# EAGLE design STM32L486_Test (EAGLE 7.5.0)
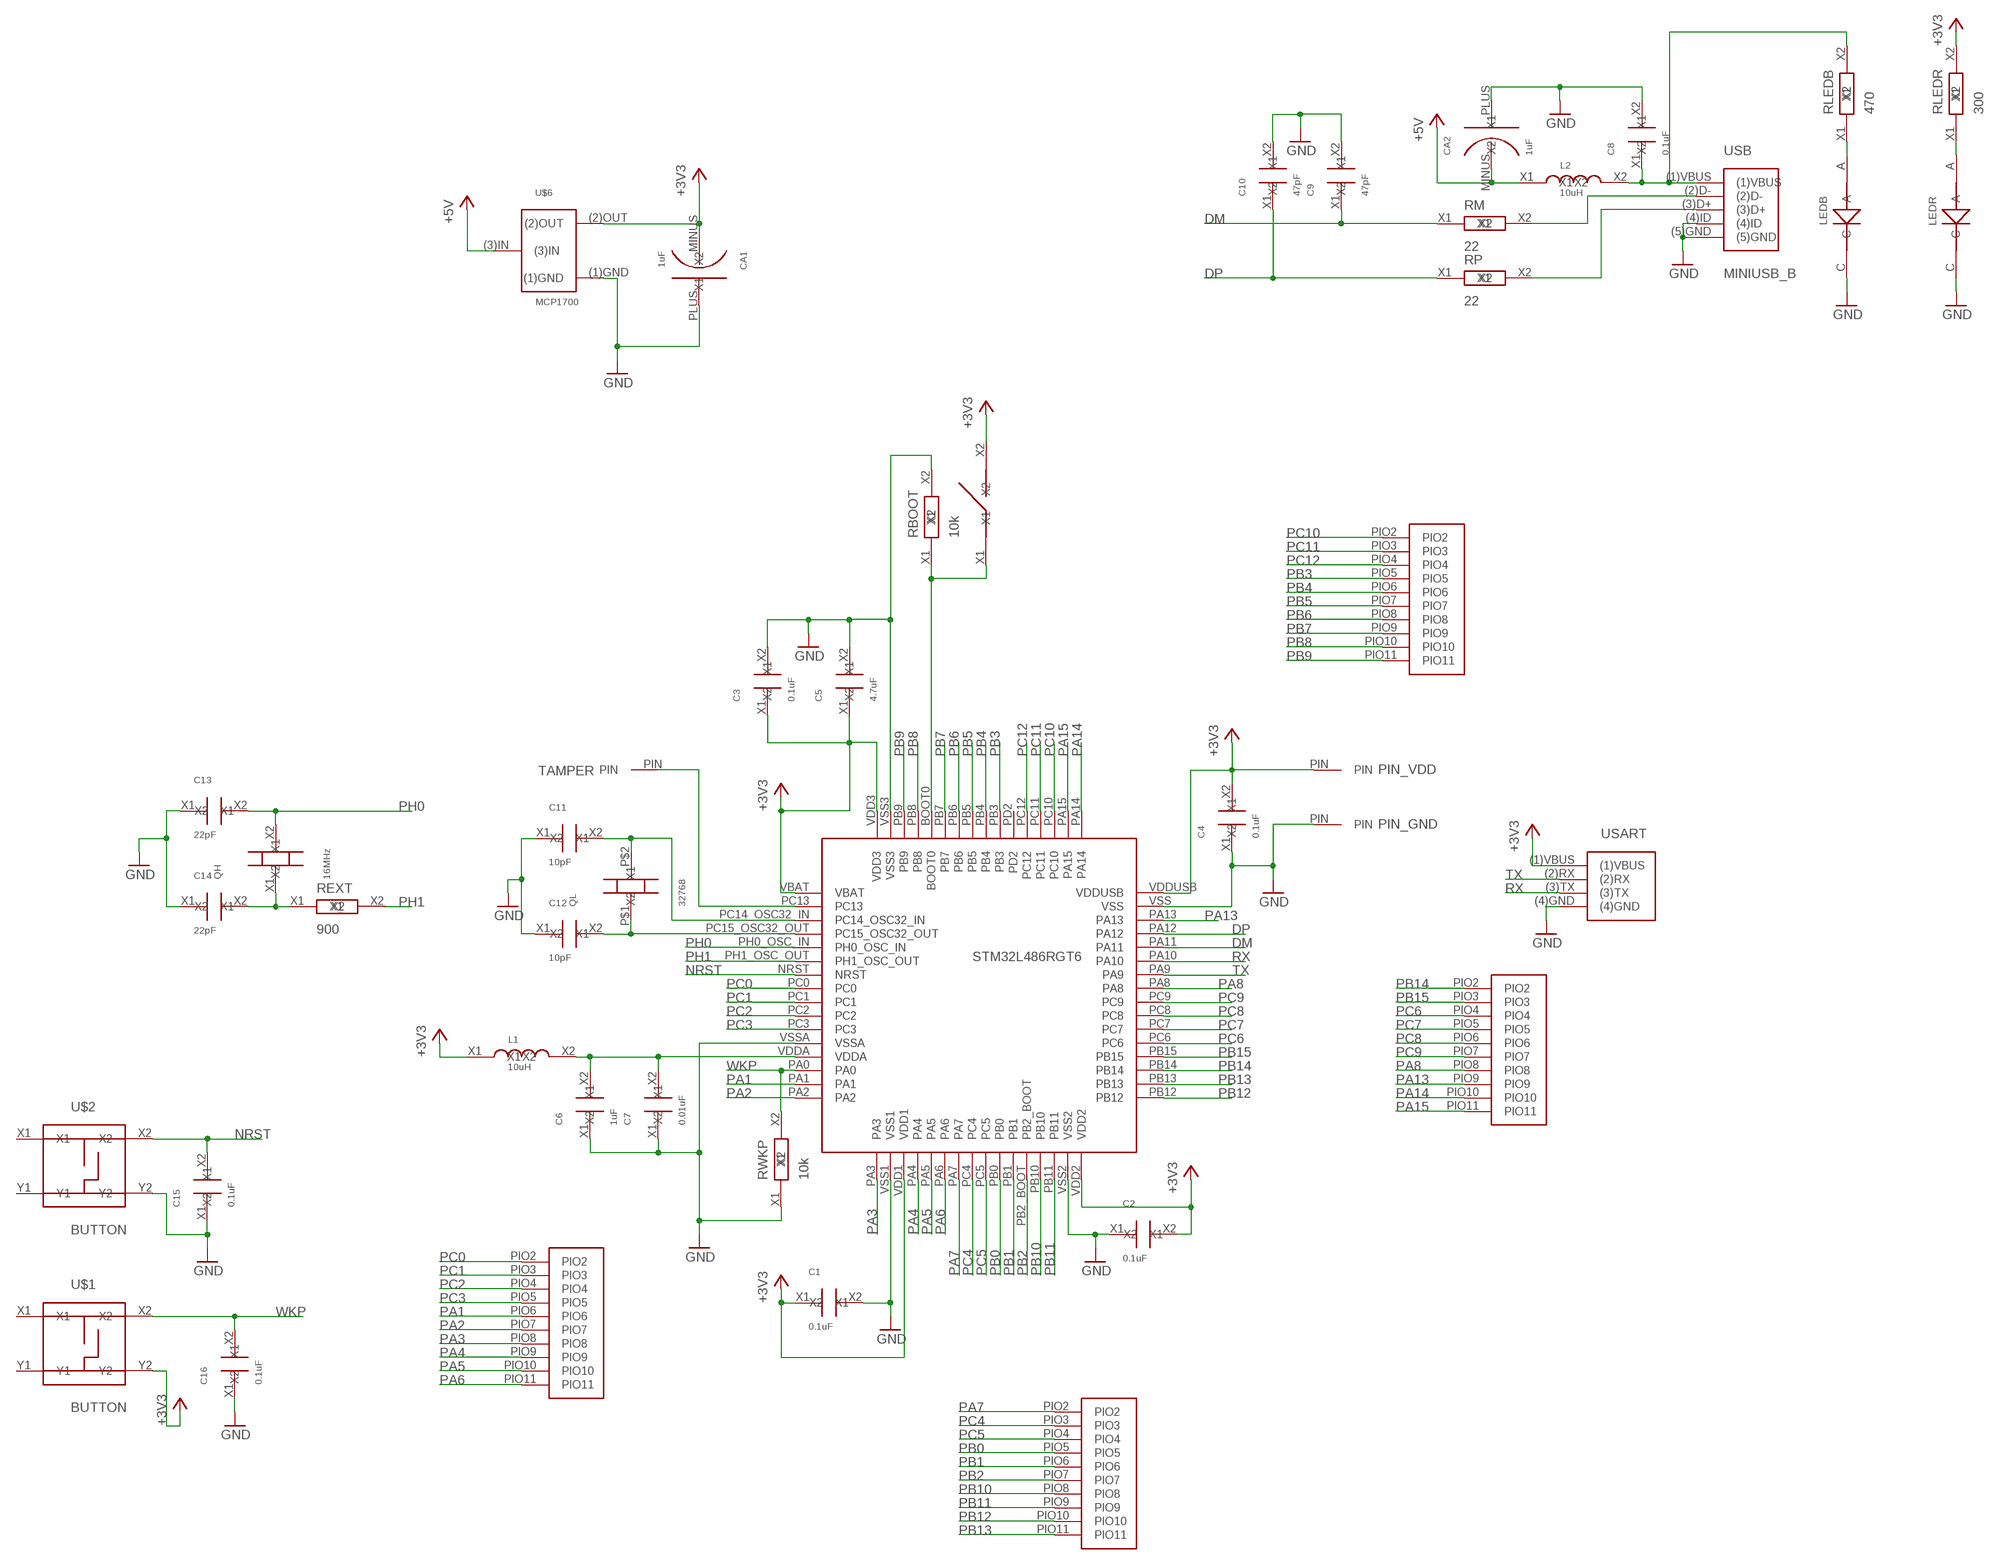
[diagram p0: schematic, sheet 1]

## Parts
C1  0.1uF  C_SMD_2.1X1.25  [SMD_2.1X1.25]
C2  0.1uF  C_SMD_2.1X1.25  [SMD_2.1X1.25]
C3  0.1uF  C_SMD_2.1X1.25  [SMD_2.1X1.25]
C4  0.1uF  C_SMD_2.1X1.25  [SMD_2.1X1.25]
C5  4.7uF  C_SMD_2.1X1.25  [SMD_2.1X1.25]
C6  1uF  C_SMD_2.1X1.25  [SMD_2.1X1.25]
C7  0.01uF  C_SMD_2.1X1.25  [SMD_2.1X1.25]
C8  0.1uF  C_SMD_2.1X1.25  [SMD_2.1X1.25]
C9  47pF  C_SMD_2.1X1.25  [SMD_2.1X1.25]
C10  47pF  C_SMD_2.1X1.25  [SMD_2.1X1.25]
C11  10pF  C_SMD_2.1X1.25  [SMD_2.1X1.25]
C12  10pF  C_SMD_2.1X1.25  [SMD_2.1X1.25]
C13  22pF  C_SMD_2.1X1.25  [SMD_2.1X1.25]
C14  22pF  C_SMD_2.1X1.25  [SMD_2.1X1.25]
C15  0.1uF  C_SMD_2.1X1.25  [SMD_2.1X1.25]
C16  0.1uF  C_SMD_2.1X1.25  [SMD_2.1X1.25]
CA1  1uF  C_SMD_TA_A  [C_SMD_TA_A]
CA2  1uF  C_SMD_TA_A  [C_SMD_TA_A]
L1  10uH  L_SMD_2.1X1.25  [SMD_2.1X1.25]
L2  10uH  L_SMD_2.1X1.25  [SMD_2.1X1.25]
LEDB  LED0805  [SMD0805]
LEDR  LED0805  [SMD0805]
PIN_GND  PIN  [PIN]
PIN_VDD  PIN  [PIN]
QH  16MHz  QUARTZ_SMD  [QUARTZ_SMD]
QL  32768  QUARTZ_CYL  [QUARTZ_CYL]
RBOOT  10k  R_SMD_2.1X1.25  [SMD_2.1X1.25]
REXT  900  R_SMD_2.1X1.25  [SMD_2.1X1.25]
RLEDB  470  R_SMD_2.1X1.25  [SMD_2.1X1.25]
RLEDR  300  R_SMD_2.1X1.25  [SMD_2.1X1.25]
RM  22  R_SMD_2.1X1.25  [SMD_2.1X1.25]
RP  22  R_SMD_2.1X1.25  [SMD_2.1X1.25]
RWKP  10k  R_SMD_2.1X1.25  [SMD_2.1X1.25]
STM32L486RGT6  STM32L486  [STM32L486]
TAMPER  PIN  [PIN]
U$1  BUTTON  [BUTTON]
U$2  BUTTON  [BUTTON]
U$3  PIO_10  [PIO_10]
U$4  PIO_10  [PIO_10]
U$5  PIO_10  [PIO_10]
U$6  MCP1700  [MCP1700]
U$7  PIO_10  [PIO_10]
U$9  DIP_1  [DIP_1]
USART  USART  [USART]
USB  MINIUSB_B  [MINIUSB_B]

## Nets
+3V3: C1.X1 C2.X2 C3.X1 C4.X2 C5.X1 CA1.MINUS(X1) L1.X1 PIN_VDD.PIN RLEDR.X2 STM32L486RGT6.VBAT STM32L486RGT6.VDD1 STM32L486RGT6.VDD2 STM32L486RGT6.VDD3 STM32L486RGT6.VDDUSB U$1.Y2 U$6.(2)OUT U$9.X2 USART.(1)VBUS
+5V: CA2.MINUS(X1) L2.X1 U$6.(3)IN
DM: C9.X1 RM.X1 STM32L486RGT6.PA11
DP: C10.X1 RP.X1 STM32L486RGT6.PA12
GND: C1.X2 C2.X1 C3.X2 C4.X1 C5.X2 C6.X1 C7.X1 C8.X2 C9.X2 C10.X2 C11.X1 C12.X1 C13.X1 C14.X1 C15.X1 C16.X1 CA1.PLUS(X2) CA2.PLUS(X2) LEDB.C LEDR.C PIN_GND.PIN RBOOT.X2 RWKP.X1 STM32L486RGT6.VSS STM32L486RGT6.VSS1 STM32L486RGT6.VSS2 STM32L486RGT6.VSS3 STM32L486RGT6.VSSA U$2.Y2 U$6.(1)GND USART.(4)GND USB.(4)ID USB.(5)GND
N$2: RBOOT.X1 STM32L486RGT6.BOOT0 U$9.X1
N$3: C11.X2 QL.P$2(X2) STM32L486RGT6.PC14_OSC32_IN
N$4: LEDB.A RLEDB.X1
N$5: C8.X1 L2.X2 RLEDB.X2 USB.(1)VBUS
N$6: RM.X2 USB.(2)D-
N$7: RP.X2 USB.(3)D+
N$8: LEDR.A RLEDR.X1
N$9: C12.X2 QL.P$1(X1) STM32L486RGT6.PC15_OSC32_OUT
N$10: STM32L486RGT6.PC13 TAMPER.PIN
N$13: C14.X2 QH.X1 REXT.X1
NRST: C15.X2 STM32L486RGT6.NRST U$2.X2
PA1: STM32L486RGT6.PA1 U$3.PIO6
PA2: STM32L486RGT6.PA2 U$3.PIO7
PA3: STM32L486RGT6.PA3 U$3.PIO8
PA4: STM32L486RGT6.PA4 U$3.PIO9
PA5: STM32L486RGT6.PA5 U$3.PIO10
PA6: STM32L486RGT6.PA6 U$3.PIO11
PA7: STM32L486RGT6.PA7 U$4.PIO2
PA8: STM32L486RGT6.PA8 U$5.PIO8
PA13: STM32L486RGT6.PA13 U$5.PIO9
PA14: STM32L486RGT6.PA14 U$5.PIO10
PA15: STM32L486RGT6.PA15 U$5.PIO11
PB0: STM32L486RGT6.PB0 U$4.PIO5
PB1: STM32L486RGT6.PB1 U$4.PIO6
PB2: STM32L486RGT6.PB2_BOOT U$4.PIO7
PB3: STM32L486RGT6.PB3 U$7.PIO5
PB4: STM32L486RGT6.PB4 U$7.PIO6
PB5: STM32L486RGT6.PB5 U$7.PIO7
PB6: STM32L486RGT6.PB6 U$7.PIO8
PB7: STM32L486RGT6.PB7 U$7.PIO9
PB8: STM32L486RGT6.PB8 U$7.PIO10
PB9: STM32L486RGT6.PB9 U$7.PIO11
PB10: STM32L486RGT6.PB10 U$4.PIO8
PB11: STM32L486RGT6.PB11 U$4.PIO9
PB12: STM32L486RGT6.PB12 U$4.PIO10
PB13: STM32L486RGT6.PB13 U$4.PIO11
PB14: STM32L486RGT6.PB14 U$5.PIO2
PB15: STM32L486RGT6.PB15 U$5.PIO3
PC0: STM32L486RGT6.PC0 U$3.PIO2
PC1: STM32L486RGT6.PC1 U$3.PIO3
PC2: STM32L486RGT6.PC2 U$3.PIO4
PC3: STM32L486RGT6.PC3 U$3.PIO5
PC4: STM32L486RGT6.PC4 U$4.PIO3
PC5: STM32L486RGT6.PC5 U$4.PIO4
PC6: STM32L486RGT6.PC6 U$5.PIO4
PC7: STM32L486RGT6.PC7 U$5.PIO5
PC8: STM32L486RGT6.PC8 U$5.PIO6
PC9: STM32L486RGT6.PC9 U$5.PIO7
PC10: STM32L486RGT6.PC10 U$7.PIO2
PC11: STM32L486RGT6.PC11 U$7.PIO3
PC12: STM32L486RGT6.PC12 U$7.PIO4
PH0: C13.X2 QH.X2 STM32L486RGT6.PH0_OSC_IN
PH1: REXT.X2 STM32L486RGT6.PH1_OSC_OUT
RX: STM32L486RGT6.PA10 USART.(3)TX
TX: STM32L486RGT6.PA9 USART.(2)RX
VDDA: C6.X2 C7.X2 L1.X2 STM32L486RGT6.VDDA
WKP: C16.X2 RWKP.X2 STM32L486RGT6.PA0 U$1.X2
Unconnected: STM32L486RGT6.PD2 U$1.X1 U$1.Y1 U$2.X1 U$2.Y1

## Library data of the parts
C1-C16 = MyPowerComponents:C_SMD_2.1X1.25
CA1 CA2 = MyAmSys:C_SMD_TA_A
L1 L2 = MyPowerComponents:L_SMD_2.1X1.25
LEDB LEDR = My_BLE:LED0805
PIN_GND PIN_VDD TAMPER = MySTM32F103RGT6:PIN
QH = MySTM32F103RGT6:QUARTZ_SMD
QL = MySTM32F103RGT6:QUARTZ_CYL
RBOOT REXT RLEDB RLEDR RM RP RWKP = MyPowerComponents:R_SMD_2.1X1.25
STM32L486RGT6 = My_STM32L486:STM32L486
U$1 U$2 = My_STM32:BUTTON
U$3-U$5 U$7 = My_BLE:PIO_10
U$6 = MyCMOSsensor:MCP1700
U$9 = My_STM32L15x:DIP_1
USART = MyCMOSsensor:USART
USB = MyCMOSsensor:MINIUSB_B

## Board
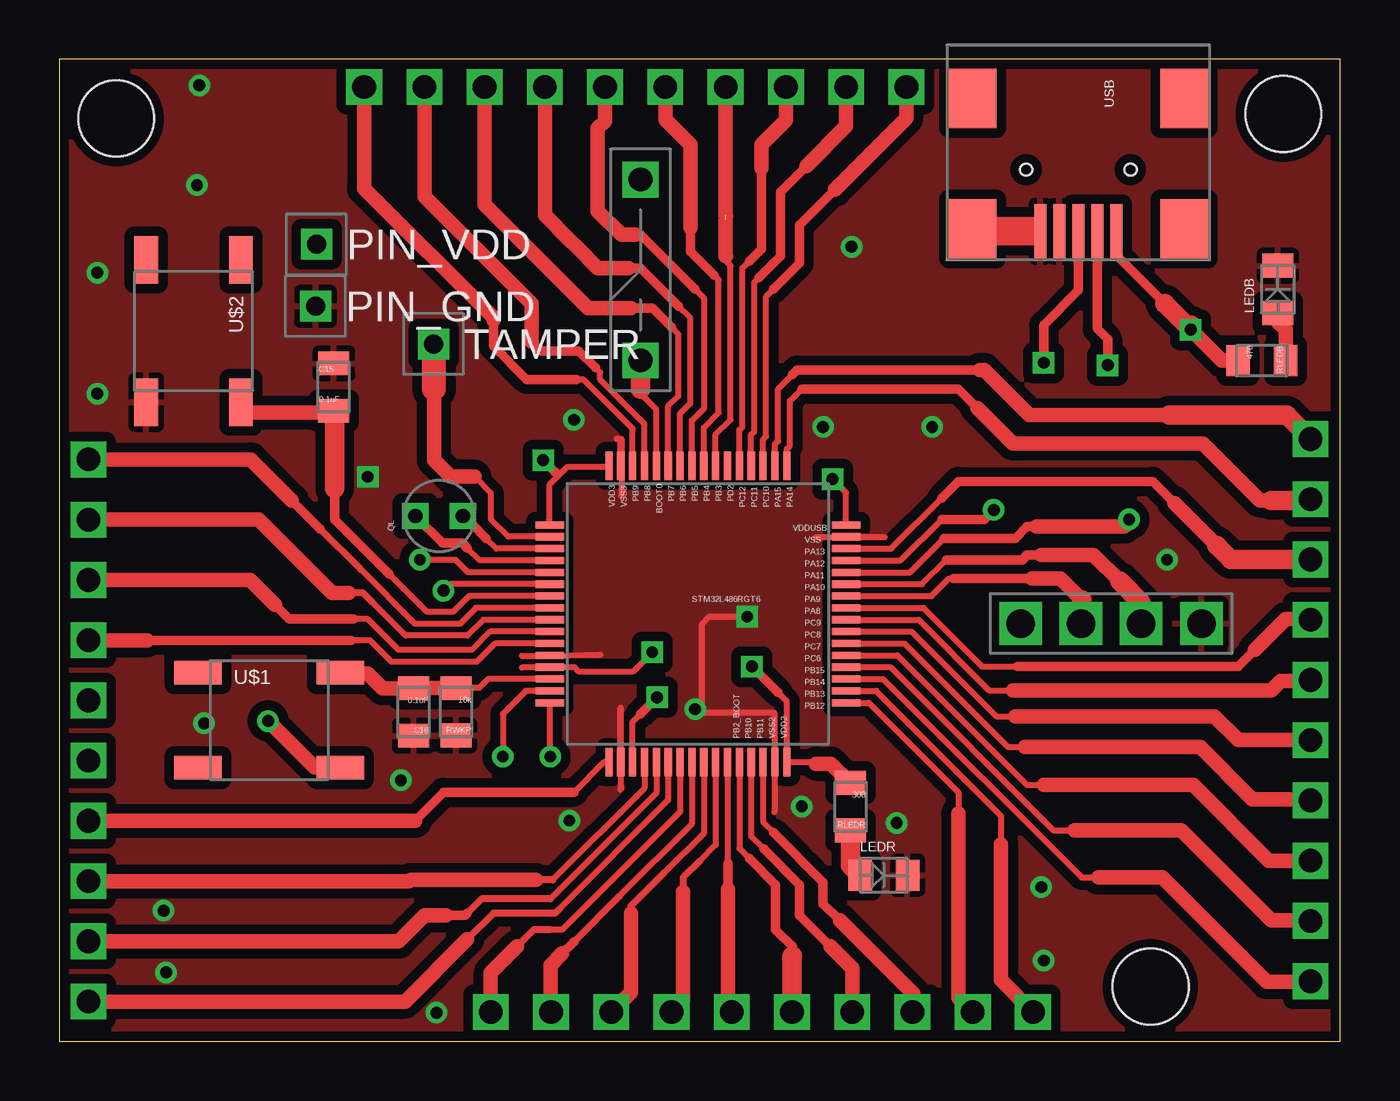
[diagram p1: board, top side]
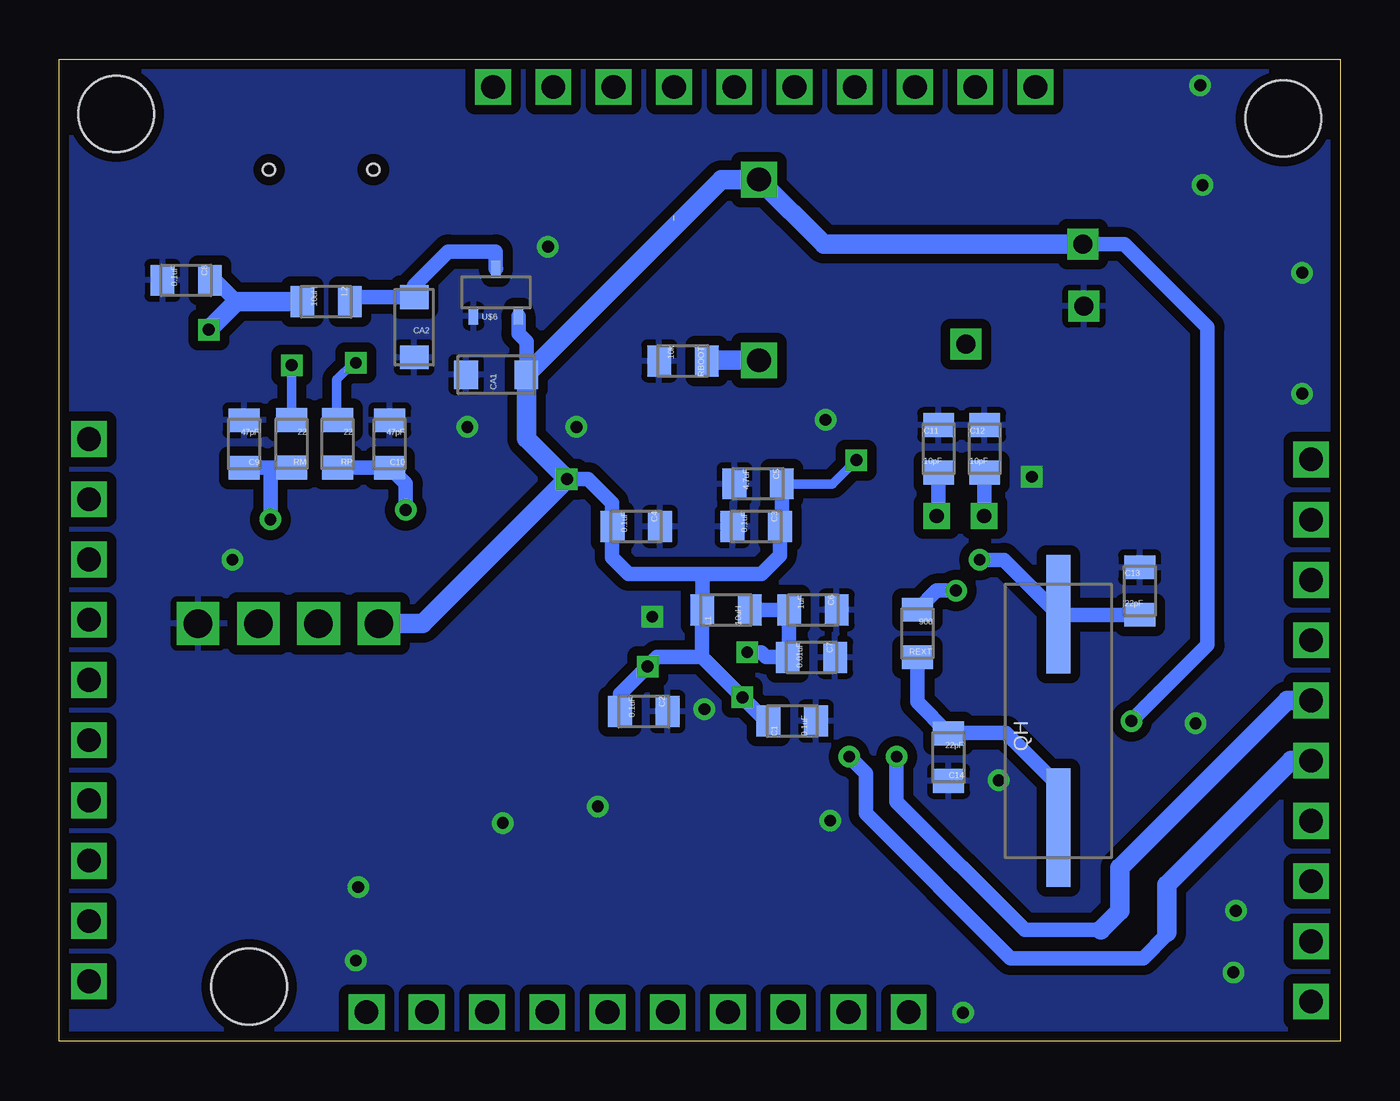
[diagram p2: board, bottom side, seen from below]

Size 54 x 41.4 mm. Coordinates in mm from the lower left corner, seen from the top.
Outline: 0,0 54,0 54,41.4 0,41.4 0,0
Copper layers (1*16): Top 0.035mm / dielectric 1.5mm / Bottom 0.035mm
Design rules "default *": minimum track width 10mil, minimum drill 24mil, track to track 8mil, track to pad 8mil, pad to pad 8mil, via to via 8mil, smd to smd 8mil, copper to edge 10mil, drill to drill 8mil, minimum pad ring 10mil, minimum via ring 8mil, stop-mask expansion 4mil, vias tented up to drill 0mil, thermal gap 10mil
Holes 3.2 mm at 46,2.3 2.4,38.9 51.6,39.1

### Footprints (pad centres in the part's own frame; a part is rotated, then mirrored left to right if it is on the bottom)
SMD_2.1X1.25 = smd 1.3 x 1: X1 0,1; X2 0,-1
C_SMD_TA_A = smd 1.2 x 1: MINUS 0,-1.27; PLUS 0,1.27
SMD0805 = smd 1 x 1.3: A -1,0; C 1,0
PIN = drill 0.8 square: PIN 0,0
QUARTZ_SMD = smd 5 x 1: X1 -4.5,0; X2 4.5,0
QUARTZ_CYL = drill 0.6 square: P$1 0,1; P$2 0,-1
STM32L486 = smd 0.3 x 1.2: BOOT0 -1.75,6.25; PA3 -3.75,-6.25; PA4 -2.25,-6.25; PA5 -1.75,-6.25; PA6 -1.25,-6.25; PA7 -0.75,-6.25; PA14 3.75,6.25; PA15 3.25,6.25; PB0 0.75,-6.25; PB1 1.25,-6.25; PB2_BOOT 1.75,-6.25; PB3 0.75,6.25; PB4 0.25,6.25; PB5 -0.25,6.25; PB6 -0.75,6.25; PB7 -1.25,6.25; PB8 -2.25,6.25; PB9 -2.75,6.25; PB10 2.25,-6.25; PB11 2.75,-6.25; PC4 -0.25,-6.25; PC5 0.25,-6.25; PC10 2.75,6.25; PC11 2.25,6.25; PC12 1.75,6.25; PD2 1.25,6.25; VDD1 -2.75,-6.25; VDD2 3.75,-6.25; VDD3 -3.75,6.25; VSS1 -3.25,-6.25; VSS2 3.25,-6.25; VSS3 -3.25,6.25 | smd 1.2 x 0.3: NRST -6.25,0.75; PA0 -6.25,-2.75; PA1 -6.25,-3.25; PA2 -6.25,-3.75; PA8 6.25,0.25; PA9 6.25,0.75; PA10 6.25,1.25; PA11 6.25,1.75; PA12 6.25,2.25; PA13 6.25,2.75; PB12 6.25,-3.75; PB13 6.25,-3.25; PB14 6.25,-2.75; PB15 6.25,-2.25; PC0 -6.25,0.25; PC1 -6.25,-0.25; PC2 -6.25,-0.75; PC3 -6.25,-1.25; PC6 6.25,-1.75; PC7 6.25,-1.25; PC8 6.25,-0.75; PC9 6.25,-0.25; PC13 -6.25,3.25; PC14_OSC32_IN -6.25,2.75; PC15_OSC32_OUT -6.25,2.25; PH0_OSC_IN -6.25,1.75; PH1_OSC_OUT -6.25,1.25; VBAT -6.25,3.75; VDDA -6.25,-2.25; VDDUSB 6.25,3.75; VSS 6.25,3.25; VSSA -6.25,-1.75
BUTTON = smd 2 x 1: X1 -3,2; X2 3,2; Y1 -3,-2; Y2 3,-2
PIO_10 = drill 1 square: PIO2 0,12.7; PIO3 0,10.16; PIO4 0,7.62; PIO5 0,5.08; PIO6 0,2.54; PIO7 0,0; PIO8 0,-2.54; PIO9 0,-5.08; PIO10 0,-7.62; PIO11 0,-10.16
MCP1700 = smd 0.4 x 0.7: (1)GND -0.95,-2; (2)OUT 0.95,-2; (3)IN 0,0
DIP_1 = drill 1 square: X1 0,2.54; X2 0,-5.08
USART = drill 1.2 square: (1)VBUS 0,5.08; (2)RX 0,2.54; (3)TX 0,0; (4)GND 0,-2.54
MINIUSB_B = smd 2.3 x 0.5: (1)VBUS 0,1.6; (2)D- 0,0.8; (3)D+ 0,0; (4)ID 0,-0.8; (5)GND 0,-1.6 | smd 2.5 x 2: PG1 -0.1,-4.45; PG2 -5.6,-4.45; PG3 -5.6,4.45; PG4 -0.1,4.45 | hole 0.5: -2.6,2.2; -2.6,-2.2

### Placement (x,y rotation side)
C1  23.1,13.5 90 bottom
C2  29.36,13.9 270 bottom
C3  24.62,21.7 270 bottom
C4  29.68,21.7 270 bottom
C5  24.54,23.5 270 bottom
C6  22.23,18.18 270 bottom
C7  22.29,16.18 270 bottom
C8  48.65,32.08 270 bottom
C9  46.21,25.18 180 bottom
C10  40.07,25.18 180 bottom
C11  16.93,24.98 0 bottom
C12  14.99,24.98 0 bottom
C13  8.45,18.98 0 bottom
C14  16.51,11.98 180 bottom
C15  11.57,27.58 0 top
C16  14.93,13.88 180 top
CA1  35.58,28.1 90 bottom
CA2  39.04,30.1 180 bottom
L1  25.89,18.18 90 bottom
L2  42.75,31.18 270 bottom
LEDB  51.37,31.7 90 top
LEDR  34.76,7 0 top
PIN_GND  10.8,30.99 0 top
PIN_VDD  10.84,33.6 0 top
QH  11.88,13.5 90 bottom
QL  16.01,22.14 90 top
RBOOT  27.71,28.68 270 bottom
REXT  17.83,17.19 180 bottom
RLEDB  50.69,28.69 270 top
RLEDR  33.35,9.89 180 top
RM  44.21,25.19 180 bottom
RP  42.27,25.19 180 bottom
RWKP  16.73,13.89 180 top
STM32L486RGT6  26.92,18.02 0 top
TAMPER  15.78,29.4 0 top
U$1  8.85,13.54 0 top
U$2  5.66,29.94 270 top
U$3  1.23,11.83 0 top
U$4  30.89,1.23 90 top
U$5  52.75,15.23 180 top
U$6  35.59,32.57 0 bottom
U$7  23.01,40.23 270 top
U$9  24.5,31.25 180 top
USART  45.61,17.61 90 top
USB  42.96,34.15 270 top

### Tracks (layer width: path | path; a pad name or v marks a point on that pad's centre or on a via)
+3V3  (via drill 0.5, 0.5 pad 0.25)
  Top 0.254: STM32L486RGT6.VBAT 20.67,23.47 21,23.8 | STM32L486RGT6.VDD3 23.1,24.2 21.4,24.2 21,23.8 | 21,23.8 21,23.9 20.9,24 | STM32L486RGT6.VDD1 24.17,13.47 24.5,13.8 | 30.3,14.7 30.67,14.33 STM32L486RGT6.VDD2 31.83,11.77 31.9,11.7 | STM32L486RGT6.VDDUSB 33.17,23.13 v32.6,23.7
  Top 0.406: 20.9,24 v20.4,24.5 | 24.5,13.8 v25.2,14.5 | 30.3,14.7 v29.2,15.8
  Top 0.61: 31.9,11.7 32.54,11.7 RLEDR.X2 | U$1.Y2 10.76,11.54 v8.8,13.5
  Bottom 0.406: v20.4,24.5 21.4,23.5 C5.X1 | v25.2,14.5 25.1,14.5 C1.X1
  Bottom 0.61: 27,19.7 24.4,19.7 23.62,20.48 C3.X1 23.54,21.78 C5.X1 | 27,19.7 30,19.7 30.7,20.4 30.7,21.68 C4.X2 30.7,21.72 30.7,22.7 31.7,23.7 v32.6,23.7 | 27,19.7 26.89,19.59 L1.X1 26.9,16.2 | C1.X1 24.2,13.5 v25.2,14.5 26.9,16.2 | C2.X2 30.36,14.64 v29.2,15.8 28.8,16.2 26.9,16.2 | U$6.(2)OUT 34.64,29.84 34.3,29.5 CA1.MINUS | v8.8,13.5 5.6,16.7 5.6,30.1 9.1,33.6 PIN_VDD.PIN
  Bottom 0.813: CA1.MINUS 34.3,25.4 v32.6,23.7 38.69,17.61 USART.(1)VBUS | CA1.MINUS 26.08,36.33 U$9.X2 21.77,33.6 PIN_VDD.PIN
+5V
  Bottom 0.61: U$6.(3)IN 35.6,33.3 37.6,33.3 39.04,31.86 CA2.MINUS 41.56,31.37 L2.X1
DM  (via drill 0.5)
  Top 0.254: STM32L486RGT6.PA11 35.87,19.77 37.3,21.2
  Top 0.406: 37.3,21.2 40.3,21.2 40.8,21.7 41.2,21.7
  Top 0.61: 41.2,21.7 44.9,21.7 45.1,21.9 v45.1,22
  Bottom 0.61: C9.X1 45.1,24.18 | 45.1,24.18 RM.X1 | v45.1,22 45.1,24.18
DP  (via drill 0.5)
  Top 0.254: STM32L486RGT6.PA12 35.47,20.27 37.2,22
  Top 0.406: 37.2,22 39,22 v39.4,22.4
  Bottom 0.61: RP.X1 C10.X1 39.4,23.51 v39.4,22.4
GND  (via drill 0.5)
  Top 0.254: 23.5,25.4 23.7,25.4 23.7,25.3 | 23.7,25.3 23.7,23 | STM32L486RGT6.VSS3 23.67,25.27 23.7,25.3 | 19.5,16.25 20.74,16.25 | 20.74,16.25 STM32L486RGT6.VSSA | 20.74,16.25 22.8,16.3 | 23.65,10.6 23.65,11.85 23.67,14.07 STM32L486RGT6.VSS1 | 30.15,11.35 30.15,13.85 27.15,13.85 27.1,13.9 27.1,17.6 27.4,17.9 v29,17.9 | 30.15,11.35 30.15,9.65 | STM32L486RGT6.VSS2 30.17,12.37 30.15,11.35 | 31.9,21.25 34.7,21.25 | 34.7,21.25 34.8,21.25 | STM32L486RGT6.VSS 34.18,21.27 34.7,21.25
  other vias: 13,23.8 6.1,13.4 14.4,11 21.5,9.3 4.4,5.5 4.5,2.9 15.9,1.2 26.8,14 31.3,9.9 35.3,9.2 21.7,26.2 32.2,25.9 36.8,25.9 46.7,20.3 33.4,33.5 41.4,6.5 41.5,3.4 1.6,27.3 1.6,32.4 5.8,36.1 5.9,40.3
  pour Bottom (isolate 0.406): 0,0 54,0 54,41.4 0,41.4
  pour Top (isolate 0.406): 0,0 54,0 54,41.4 0,41.4
N$2
  Top 0.254: STM32L486RGT6.BOOT0 25.17,26.63 24.5,27.3 24.5,27.5
  Top 0.813: 24.5,27.5 U$9.X1
  Bottom 0.813: U$9.X1 26.68,28.71 RBOOT.X1
N$3
  Top 0.254: STM32L486RGT6.PC14_OSC32_IN 18.43,20.77 18,21.2
  Top 0.406: 18,21.2 17.4,21.8 17.35,21.8 QL.P$2
  Bottom 0.61: C11.X2 16.93,22.22 QL.P$2
N$4
  Top 0.61: LEDB.A 51.37,30.33 51.7,30 RLEDB.X1
N$5  (via drill 0.5)
  Top 0.406: USB.(1)VBUS 44.56,33.14 46.6,31.1
  Top 0.61: RLEDB.X2 49.01,28.69 v47.7,30
  Top 0.813: 47.7,30.2 v47.7,30 46.6,31.1
  Bottom 0.61: C8.X1 47.42,32.08 46.52,31.18
  Bottom 0.813: L2.X2 46.52,31.18 v47.7,30
N$6  (via drill 0.5)
  Top 0.406: USB.(2)D- 43.76,30.04 44.2,29.6 v44.2,28.5
  Bottom 0.406: v44.2,28.5 RM.X2
N$7  (via drill 0.5)
  Top 0.406: USB.(3)D+ 42.96,31.66 41.5,30.2 v41.5,28.6
  Bottom 0.406: v41.5,28.6 41.6,28.6 42.3,27.9 42.3,26.22 RP.X2
N$8
  Top 0.813: RLEDR.X1 33.35,7.41 LEDR.A
N$9
  Top 0.254: STM32L486RGT6.PC15_OSC32_OUT 17.73,20.27 17.2,20.8
  Top 0.406: 17.2,20.8 17,21 16.15,21 QL.P$1
  Bottom 0.61: C12.X2 14.99,22.16 QL.P$1
N$10
  Top 0.254: STM32L486RGT6.PC13 18.93,21.27 18.2,22 18.2,23.1 17.5,23.8
  Top 0.61: 17.5,23.8 16.5,23.8 15.8,24.5 15.8,27.5
  Top 1.016: 15.8,27.5 15.8,29.38 TAMPER.PIN
N$13
  Bottom 0.61: REXT.X1 17.83,14.3 C14.X2 16.49,13 14.1,13 11.88,10.78 QH.X1
NRST
  Top 0.254: STM32L486RGT6.NRST 17.27,18.77 16.6,18.1 15.5,18.1 13.9,19.7
  Top 0.406: 13.9,19.7 11.6,22 11.6,23.3
  Top 0.61: U$2.X2 7.66,26.64 7.8,26.5 11.49,26.5 C15.X2
  Top 0.813: 11.6,23.3 11.6,26.55 C15.X2
PA1  (via drill 0.5)
  Top 0.254: STM32L486RGT6.PA1 19.67,14.77 18.7,13.8 v18.7,12
  Bottom 0.61: v18.7,12 18.7,10.1 13.3,4.7 10.1,4.7
  Bottom 0.813: U$3.PIO6 2.23,14.37 9.3,7.3 9.3,5.5 10.1,4.7
PA2  (via drill 0.5)
  Top 0.254: STM32L486RGT6.PA2 20.67,12.03 v20.7,12
  Bottom 0.61: 7.3,4.6 7.3,4.5 8.3,3.5 13.9,3.5 20,9.6 20,11.3 v20.7,12
  Bottom 0.813: U$3.PIO7 2.07,11.83 7.3,6.6 7.3,4.6
PA3
  Top 0.254: STM32L486RGT6.PA3 22.97,11.77 21.7,10.5
  Top 0.406: 14.99,9.29 16.2,10.5 21.7,10.5
  Top 0.61: U$3.PIO8 14.99,9.29
PA4
  Top 0.254: STM32L486RGT6.PA4 24.67,10.67 20.8,6.8
  Top 0.305: 20.8,6.8 20.1,6.8
  Top 0.61: U$3.PIO9 14.75,6.75 14.8,6.8 20.1,6.8
PA5
  Top 0.254: STM32L486RGT6.PA5 25.17,10.47 20.7,6
  Top 0.305: 20.7,6 17.8,6 17.2,5.4
  Top 0.406: 16.3,5.3 17.1,5.3 17.2,5.4
  Top 0.61: U$3.PIO10 14.31,4.21 15.4,5.3 16.3,5.3
PA6
  Top 0.254: STM32L486RGT6.PA6 25.67,10.17 21.1,5.6
  Top 0.305: 21.1,5.6 20.9,5.4 18.3,5.4 17.2,4.3
  Top 0.61: U$3.PIO11 14.57,1.67 17.2,4.3
PA7
  Top 0.254: STM32L486RGT6.PA7 26.17,9.67 21.2,4.7 20.7,4.7
  Top 0.305: 20.7,4.7 20,4.7 19.3,4
  Top 0.61: U$4.PIO2 18.19,2.89 19.3,4
PA8
  Top 0.254: STM32L486RGT6.PA8 36.43,18.27 38.9,15.8 40.4,15.8
  Top 0.406: 40.4,15.8 49.7,15.8 50.4,16.5
  Top 0.61: 50.4,16.5 51.7,17.8 52.72,17.8
  Top 0.813: 52.72,17.8 U$5.PIO8
PA13
  Top 0.254: STM32L486RGT6.PA13 35.07,20.77 37.2,22.9
  Top 0.406: 37.2,22.9 37.9,23.6 46.1,23.6 47,22.7
  Top 0.61: 47,22.7 48.8,20.9
  Top 0.813: U$5.PIO9 49.39,20.31 48.8,20.9
PA14
  Top 0.254: STM32L486RGT6.PA14 30.67,24.97 30.8,25.1 30.8,27 31.3,27.5
  Top 0.406: 31.3,27.5 37.9,27.5 38.7,26.7
  Top 0.61: 38.7,26.7 40.2,25.2 48.2,25.2 50.6,22.8 51.1,22.8
  Top 0.813: 51.1,22.8 52.7,22.8 U$5.PIO10
PA15
  Top 0.254: STM32L486RGT6.PA15 30.17,25.17 30.3,25.3 30.3,27.5 30.9,28.1
  Top 0.406: 30.9,28.1 31.1,28.3 38.8,28.3
  Top 0.61: 38.8,28.3 39,28.3 40.9,26.4 46.8,26.4
  Top 0.813: 46.8,26.4 51.74,26.4 U$5.PIO11
PB0
  Top 0.254: STM32L486RGT6.PB0 27.67,8.27 27,7.6
  Top 0.305: 27,7.6 26.3,6.9 26.3,6.3
  Top 0.61: 26.3,6.3 26.3,1.72 U$4.PIO5
PB1
  Top 0.254: STM32L486RGT6.PB1 28.17,7.53 28.2,7.5
  Top 0.406: 28.2,7.5 28.2,6.4
  Top 0.61: 28.2,6.4 28.2,1.38 U$4.PIO6
PB2
  Top 0.254: STM32L486RGT6.PB2_BOOT 28.67,8.13 29.1,7.7
  Top 0.406: 29.1,7.7 30.2,6.6 30.2,4.7 30.9,4 30.9,3.6
  Top 0.813: U$4.PIO7 30.89,3.59 30.9,3.6
PB3  (1 unrouted)
  Top 0.254: STM32L486RGT6.PB3 27.67,25.57 28.3,26.2 28.3,32.7 28.1,32.9 28.1,33.1
  Top 0.61: U$7.PIO5 28.09,34.8 28.1,34.79 | 28.09,34.61 28.09,33.11 28.1,33.1
PB4
  Top 0.254: STM32L486RGT6.PB4 27.17,25.87 27.8,26.5 27.8,32.1 27.6,32.3
  Top 0.406: 27.6,32.3 26.6,33.3 26.6,34.3
  Top 0.61: U$7.PIO6 25.55,38.85 26.6,37.8 26.6,34.3
PB5
  Top 0.254: STM32L486RGT6.PB5 26.67,26.17 27.2,26.7 27.2,31.3 26.8,31.7
  Top 0.406: 26.8,31.7 24.5,34 24.3,34
  Top 0.61: 24.3,34 23.7,34 22.7,35 22.7,38.5 23,38.8 U$7.PIO7
PB6
  Top 0.254: STM32L486RGT6.PB6 26.17,26.47 26.6,26.9 26.6,30.5 26.1,31
  Top 0.406: 26.1,31 24.5,32.6 24,32.6
  Top 0.61: 24,32.6 22.7,32.6 21.85,33.45 21.5,33.8 20.47,34.83 U$7.PIO8
PB7
  Top 0.254: STM32L486RGT6.PB7 25.67,26.77 26.1,27.2 26.1,29.8 25.8,30.1
  Top 0.406: 24.1,30.9 25,30.9 25.8,30.1
  Top 0.61: 24.1,30.9 22.3,30.9 17.93,35.27 U$7.PIO9
PB8
  Top 0.254: STM32L486RGT6.PB8 24.67,26.03 22.8,27.9 22.8,28.2 22.6,28.4
  Top 0.406: 22.6,28.4 21.9,29.1 20.3,29.1 19.9,29.5
  Top 0.61: 19.9,29.5 19.9,31.1 15.39,35.61 U$7.PIO10
PB9
  Top 0.254: STM32L486RGT6.PB9 24.17,25.83 22.1,27.9 21.8,27.9
  Top 0.406: 21.8,27.9 19.7,27.9 18.3,29.3 18.3,30.4
  Top 0.61: 18.3,30.4 18.3,30.5 12.85,35.95 U$7.PIO11
PB10
  Top 0.254: STM32L486RGT6.PB10 29.17,8.63 29.7,8.1
  Top 0.406: 29.7,8.1 31.2,6.6 31.2,5.3 32.5,4
  Top 0.61: U$4.PIO8 33.43,3.07 32.5,4
PB11
  Top 0.254: STM32L486RGT6.PB11 29.67,9.23 30.1,8.8
  Top 0.406: 30.1,8.8 32.2,6.7 32.2,5.8 32.9,5.1
  Top 0.61: 32.9,5.1 36,2 36,1.26 U$4.PIO9
PB12
  Top 0.254: STM32L486RGT6.PB12 34.13,14.27 37.9,10.5 37.9,9.6
  Top 0.61: 37.9,9.6 37.9,1.84 U$4.PIO10
PB13
  Top 0.254: STM32L486RGT6.PB13 34.43,14.77 39.7,9.5 39.7,8.3
  Top 0.61: 39.7,8.3 39.7,2.58 U$4.PIO11
PB14
  Top 0.254: STM32L486RGT6.PB14 34.73,15.27 43.1,6.9 43.8,6.9
  Top 0.61: 43.8,6.9 46.5,6.9 50.9,2.5 52.72,2.5 U$5.PIO2
PB15
  Top 0.254: STM32L486RGT6.PB15 35.03,15.77 41.9,8.9 42.8,8.9
  Top 0.61: 42.8,8.9 47.3,8.9 51.1,5.1 52.72,5.1 U$5.PIO3
PC0
  Top 0.254: STM32L486RGT6.PC0 17.57,18.27 16.9,17.6 15,17.6 12.7,19.9
  Top 0.305: 12.7,19.9 11,21.6
  Top 0.406: 9.8,22.8 11,21.6
  Top 0.61: U$3.PIO2 8.07,24.53 9.8,22.8
PC1
  Top 0.254: STM32L486RGT6.PC1 17.87,17.77 17.2,17.1 14.6,17.1 13.2,18.5
  Top 0.305: 13.2,18.5 12.8,18.9 12.2,18.9
  Top 0.61: 12.2,18.9 11.5,18.9 10.35,20.05 10,20.4 8.41,21.99 U$3.PIO3
PC2
  Top 0.254: STM32L486RGT6.PC2 18.17,17.27 17.4,16.5 14.3,16.5 13,17.8 12.4,17.8
  Top 0.406: 12.4,17.8 9.7,17.8 9.1,18.4
  Top 0.61: U$3.PIO4 8.05,19.45 9.1,18.4
PC3
  Top 0.254: STM32L486RGT6.PC3 18.37,16.77 17.6,16 14,16 13.1,16.9 12.3,16.9
  Top 0.406: 12.3,16.9 3.7,16.9
  Top 0.61: U$3.PIO5 3.7,16.9
  Top 1.016: U$3.PIO5
PC4
  Top 0.254: STM32L486RGT6.PC4 26.67,9.17 23.6,6.1
  Top 0.305: 23.6,6.1 21.7,4.2
  Top 0.406: 21.7,4.2 21.2,3.7
  Top 0.61: 21.2,3.7 20.7,3.2 20.7,1.26 U$4.PIO3
PC5
  Top 0.254: STM32L486RGT6.PC5 27.17,8.77 25.5,7.1
  Top 0.305: 25.5,7.1 24.1,5.7 24.1,5.4
  Top 0.61: 24.1,5.4 24.1,2.06 U$4.PIO4
PC6
  Top 0.254: STM32L486RGT6.PC6 35.33,16.27 40.8,10.8 41.5,10.8
  Top 0.61: 41.5,10.8 47.8,10.8 51,7.6 U$5.PIO4
PC7
  Top 0.254: STM32L486RGT6.PC7 35.63,16.77 40,12.4 40.7,12.4
  Top 0.61: 40.7,12.4 48.1,12.4 50.3,10.2 52.7,10.2 U$5.PIO5
PC8
  Top 0.254: STM32L486RGT6.PC8 35.93,17.27 39.5,13.7 40.3,13.7
  Top 0.61: 40.3,13.7 48.7,13.7 49.7,12.7 U$5.PIO6
  Top 0.813: U$5.PIO6
PC9
  Top 0.254: STM32L486RGT6.PC9 36.23,17.77 39.2,14.8 40.2,14.8
  Top 0.61: 40.2,14.8 51.1,14.8 51.5,15.2 52.72,15.2
  Top 0.813: 52.72,15.2 U$5.PIO7
PC10
  Top 0.254: STM32L486RGT6.PC10 29.67,25.37 29.8,25.5 29.8,31.4 30.1,31.7
  Top 0.406: 30.1,31.7 31.2,32.8 31.2,34.4 32.7,35.9
  Top 0.61: U$7.PIO2 35.71,38.91 32.7,35.9
PC11
  Top 0.254: STM32L486RGT6.PC11 29.17,25.57 29.3,25.7 29.3,32 29.5,32.2
  Top 0.406: 29.5,32.2 30.4,33.1 30.4,35.8 31.5,36.9
  Top 0.61: U$7.PIO3 33.17,38.57 31.5,36.9
PC12
  Top 0.254: STM32L486RGT6.PC12 28.67,25.77 28.8,25.9 28.8,32.6 29.1,32.9
  Top 0.406: 29.1,32.9 29.6,33.4 29.6,36.8
  Top 0.61: U$7.PIO4 30.63,38.83 29.6,37.8 29.6,36.8
PH0  (via drill 0.5)
  Top 0.254: STM32L486RGT6.PH0_OSC_IN 17.23,19.77 16.7,20.3 v15.2,20.3
  Bottom 0.61: v15.2,20.3 14.18,20.3 QH.X2 11.86,17.98 C13.X2
PH1  (via drill 0.5)
  Top 0.254: STM32L486RGT6.PH1_OSC_OUT 16.47,19.27 v16.2,19
  Bottom 0.61: v16.2,19 17.02,19 REXT.X2
RX
  Top 0.254: STM32L486RGT6.PA10 36.37,19.27 37.4,20.3
  Top 0.406: 37.4,20.3 40.6,20.3 40.8,20.5 41.4,20.5
  Top 0.61: 41.4,20.5 43.6,20.5 44.7,19.4
  Top 0.813: 44.7,19.4 45.6,18.5 USART.(3)TX
TX
  Top 0.254: STM32L486RGT6.PA9 36.77,18.77 37.5,19.5 37.7,19.5
  Top 0.406: 37.7,19.5 41,19.5
  Top 0.61: 41,19.5 42.2,19.5 43.1,18.6
  Top 0.813: 43.1,18.6 43.1,17.64 USART.(2)RX
VDDA  (via drill 0.5)
  Top 0.254: v25,16.4 24.2,15.6 21.9,15.6 21.73,15.77 STM32L486RGT6.VDDA 20.64,15.75 19.5,15.75
  Bottom 0.61: L1.X2 C6.X2 23.23,16.24 C7.X2 23.31,16.2 24.2,16.2 24.4,16.4 v25,16.4
WKP
  Top 0.254: STM32L486RGT6.PA0 18.07,15.27 17.7,14.9 RWKP.X2
  Top 0.61: RWKP.X2 C16.X2 13.62,14.88 13,15.5 11.89,15.5 U$1.X2